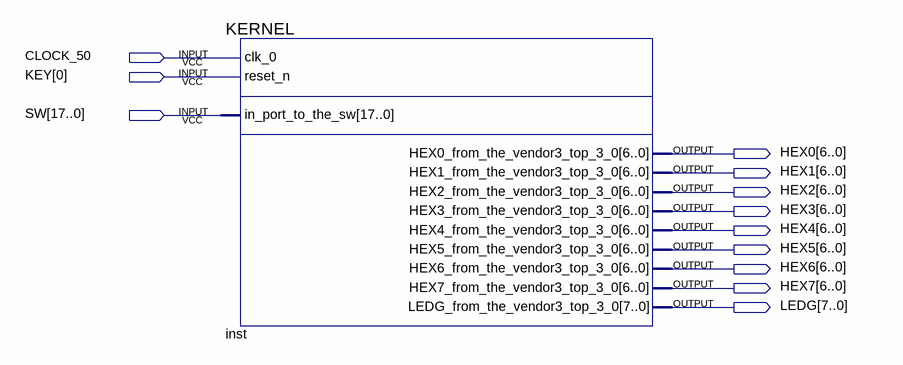
[diagram p0: schematic sheet]
// Quartus schematic avalon_sis.bdf as structural Verilog: 1 symbols, 12 pins
module avalon_sis (
  input  CLOCK_50,
  input  [0:0] KEY,
  input  [17:0] SW,
  output [6:0] HEX0,
  output [6:0] HEX1,
  output [6:0] HEX2,
  output [6:0] HEX3,
  output [6:0] HEX4,
  output [6:0] HEX5,
  output [6:0] HEX6,
  output [6:0] HEX7,
  output [7:0] LEDG
);

  KERNEL inst (
    .clk_0(CLOCK_50), .reset_n(KEY[0]), .in_port_to_the_sw(SW), .HEX0_from_the_vendor3_top_3_0(HEX0),
    .HEX1_from_the_vendor3_top_3_0(HEX1), .HEX2_from_the_vendor3_top_3_0(HEX2),
    .HEX3_from_the_vendor3_top_3_0(HEX3), .HEX4_from_the_vendor3_top_3_0(HEX4),
    .HEX5_from_the_vendor3_top_3_0(HEX5), .HEX6_from_the_vendor3_top_3_0(HEX6),
    .HEX7_from_the_vendor3_top_3_0(HEX7), .LEDG_from_the_vendor3_top_3_0(LEDG));
endmodule
